# Altium schematic sheet MAP.SchDoc
size 231 x 317 mm
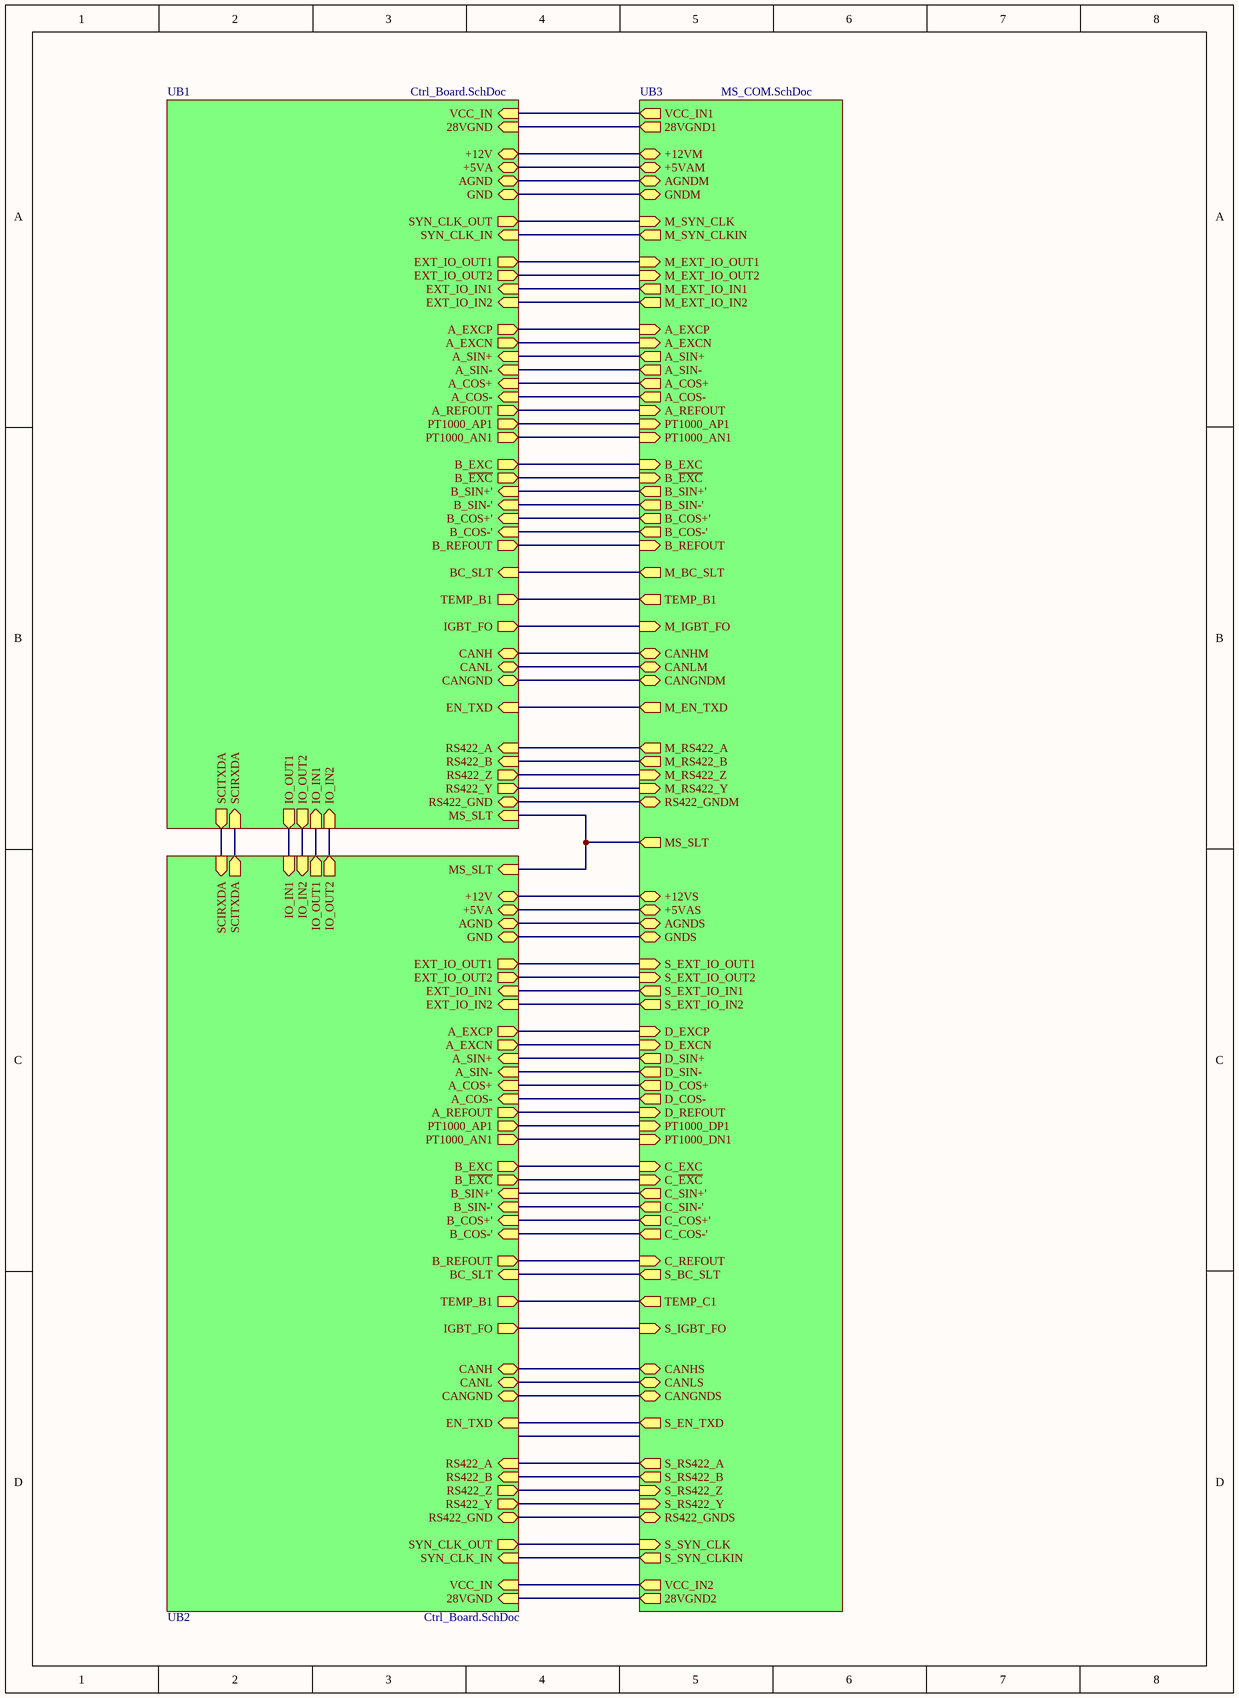
[diagram p0: MAP.SchDoc]

## Sub-sheets
UB1 = Ctrl_Board.SchDoc: IO_IN1 (in), IO_OUT1 (out), IO_OUT2 (out), IO_IN2 (in), IGBT_FO (out), EN_TXD (in), BC_SLT (in), B_EXC (out), B_SIN+' (in), B_~{EXC} (out), B_SIN-' (in), B_COS+' (in), B_COS-' (in), B_REFOUT (out), TEMP_B1 (out), RS422_A (in), RS422_B (in), RS422_Z (out), RS422_Y (out), CANL (bidir), CANH (bidir), SCIRXDA (in), SCITXDA (out), EXT_IO_OUT1 (out), EXT_IO_OUT2 (out), EXT_IO_IN1 (in), EXT_IO_IN2 (in), MS_SLT (in), CANGND (bidir), RS422_GND (bidir), +5VA (bidir), AGND (bidir), GND (bidir), +12V (bidir), SYN_CLK_IN (in), SYN_CLK_OUT (out), A_EXCP (out), A_SIN+ (in), A_EXCN (out), A_SIN- (in), A_COS+ (in), A_COS- (in), A_REFOUT (out), PT1000_AP1 (out), PT1000_AN1 (out), VCC_IN (in), 28VGND (in)
UB2 = Ctrl_Board.SchDoc: IO_IN1 (in), IO_OUT1 (out), IO_OUT2 (out), IO_IN2 (in), IGBT_FO (out), EN_TXD (in), BC_SLT (in), B_EXC (out), B_SIN+' (in), B_~{EXC} (out), B_SIN-' (in), B_COS+' (in), B_COS-' (in), B_REFOUT (out), TEMP_B1 (out), RS422_A (in), RS422_B (in), RS422_Z (out), RS422_Y (out), CANL (bidir), CANH (bidir), SCIRXDA (in), SCITXDA (out), EXT_IO_OUT1 (out), EXT_IO_OUT2 (out), EXT_IO_IN1 (in), EXT_IO_IN2 (in), MS_SLT (in), CANGND (bidir), RS422_GND (bidir), +5VA (bidir), AGND (bidir), GND (bidir), +12V (bidir), SYN_CLK_IN (in), SYN_CLK_OUT (out), A_EXCP (out), A_SIN+ (in), A_EXCN (out), A_SIN- (in), A_COS+ (in), A_COS- (in), A_REFOUT (out), PT1000_AP1 (out), PT1000_AN1 (out), VCC_IN (in), 28VGND (in)
UB3 = MS_COM.SchDoc: B_EXC (in), B_~{EXC} (in), B_SIN+' (out), B_SIN-' (out), B_COS+' (out), B_COS-' (out), B_REFOUT (in), TEMP_B1 (out), M_BC_SLT (out), M_IGBT_FO (in), M_EN_TXD (out), S_IGBT_FO (in), S_EN_TXD (out), S_BC_SLT (out), C_EXC (in), C_~{EXC} (in), C_SIN+' (out), C_SIN-' (out), C_COS+' (out), C_COS-' (out), C_REFOUT (in), TEMP_C1 (out), CANLS (bidir), CANHS (bidir), CANLM (bidir), CANHM (bidir), S_RS422_A (out), S_RS422_B (out), S_RS422_Z (in), S_RS422_Y (in), M_RS422_A (out), M_RS422_B (out), M_RS422_Z (in), M_RS422_Y (in), S_EXT_IO_OUT1 (in), S_EXT_IO_OUT2 (in), S_EXT_IO_IN1 (out), S_EXT_IO_IN2 (out), M_EXT_IO_OUT1 (in), M_EXT_IO_OUT2 (in), M_EXT_IO_IN1 (out), M_EXT_IO_IN2 (out), MS_SLT (out), CANGNDM (bidir), CANGNDS (bidir), RS422_GNDS (bidir), RS422_GNDM (bidir), +5VAM (bidir), AGNDM (bidir), GNDM (bidir), +12VM (bidir), +5VAS (bidir), AGNDS (bidir), GNDS (bidir), +12VS (bidir), M_SYN_CLK (in), M_SYN_CLKIN (out), S_SYN_CLK (in), S_SYN_CLKIN (out), A_EXCP (in), A_SIN+ (out), A_EXCN (in), A_SIN- (out), A_COS+ (out), A_COS- (out), A_REFOUT (in), PT1000_AP1 (in), PT1000_AN1 (in), D_EXCP (in), D_SIN+ (out), D_EXCN (in), D_SIN- (out), D_COS+ (out), D_COS- (out), D_REFOUT (in), PT1000_DP1 (in), PT1000_DN1 (in), VCC_IN1 (out), 28VGND1 (out), VCC_IN2 (out), 28VGND2 (out)

## Nets
(unnamed): sheet UB1/IO_IN1, sheet UB2/IO_OUT1
(unnamed): sheet UB1/IO_OUT1, sheet UB2/IO_IN1
(unnamed): sheet UB1/IO_OUT2, sheet UB2/IO_IN2
(unnamed): sheet UB1/IO_IN2, sheet UB2/IO_OUT2
(unnamed): sheet UB1/IGBT_FO, sheet UB3/M_IGBT_FO
(unnamed): sheet UB1/EN_TXD, sheet UB3/M_EN_TXD
(unnamed): sheet UB1/BC_SLT, sheet UB3/M_BC_SLT
(unnamed): sheet UB1/B_EXC, sheet UB3/B_EXC
(unnamed): sheet UB1/B_SIN+', sheet UB3/B_SIN+'
(unnamed): sheet UB1/B_~{EXC}, sheet UB3/B_~{EXC}
(unnamed): sheet UB1/B_SIN-', sheet UB3/B_SIN-'
(unnamed): sheet UB1/B_COS+', sheet UB3/B_COS+'
(unnamed): sheet UB1/B_COS-', sheet UB3/B_COS-'
(unnamed): sheet UB1/B_REFOUT, sheet UB3/B_REFOUT
(unnamed): sheet UB1/TEMP_B1, sheet UB3/TEMP_B1
(unnamed): sheet UB1/RS422_A, sheet UB3/M_RS422_A
(unnamed): sheet UB1/RS422_B, sheet UB3/M_RS422_B
(unnamed): sheet UB1/RS422_Z, sheet UB3/M_RS422_Z
(unnamed): sheet UB1/RS422_Y, sheet UB3/M_RS422_Y
(unnamed): sheet UB1/CANL, sheet UB3/CANLM
(unnamed): sheet UB1/CANH, sheet UB3/CANHM
(unnamed): sheet UB1/SCIRXDA, sheet UB2/SCITXDA
(unnamed): sheet UB1/SCITXDA, sheet UB2/SCIRXDA
(unnamed): sheet UB1/EXT_IO_OUT1, sheet UB3/M_EXT_IO_OUT1
(unnamed): sheet UB1/EXT_IO_OUT2, sheet UB3/M_EXT_IO_OUT2
(unnamed): sheet UB1/EXT_IO_IN1, sheet UB3/M_EXT_IO_IN1
(unnamed): sheet UB1/EXT_IO_IN2, sheet UB3/M_EXT_IO_IN2
(unnamed): sheet UB1/MS_SLT, sheet UB3/MS_SLT, sheet UB2/MS_SLT
(unnamed): sheet UB1/CANGND, sheet UB3/CANGNDM
(unnamed): sheet UB1/RS422_GND, sheet UB3/RS422_GNDM
(unnamed): sheet UB1/+5VA, sheet UB3/+5VAM
(unnamed): sheet UB1/AGND, sheet UB3/AGNDM
(unnamed): sheet UB1/GND, sheet UB3/GNDM
(unnamed): sheet UB1/+12V, sheet UB3/+12VM
(unnamed): sheet UB1/SYN_CLK_IN, sheet UB3/M_SYN_CLKIN
(unnamed): sheet UB1/SYN_CLK_OUT, sheet UB3/M_SYN_CLK
(unnamed): sheet UB1/A_EXCP, sheet UB3/A_EXCP
(unnamed): sheet UB1/A_SIN+, sheet UB3/A_SIN+
(unnamed): sheet UB1/A_EXCN, sheet UB3/A_EXCN
(unnamed): sheet UB1/A_SIN-, sheet UB3/A_SIN-
(unnamed): sheet UB1/A_COS+, sheet UB3/A_COS+
(unnamed): sheet UB1/A_COS-, sheet UB3/A_COS-
(unnamed): sheet UB1/A_REFOUT, sheet UB3/A_REFOUT
(unnamed): sheet UB1/PT1000_AP1, sheet UB3/PT1000_AP1
(unnamed): sheet UB1/PT1000_AN1, sheet UB3/PT1000_AN1
(unnamed): sheet UB1/VCC_IN, sheet UB3/VCC_IN1
(unnamed): sheet UB1/28VGND, sheet UB3/28VGND1
(unnamed): sheet UB3/S_IGBT_FO, sheet UB2/IGBT_FO
(unnamed): sheet UB3/S_EN_TXD, sheet UB2/EN_TXD
(unnamed): sheet UB3/S_BC_SLT, sheet UB2/BC_SLT
(unnamed): sheet UB3/C_EXC, sheet UB2/B_EXC
(unnamed): sheet UB3/C_~{EXC}, sheet UB2/B_~{EXC}
(unnamed): sheet UB3/C_SIN+', sheet UB2/B_SIN+'
(unnamed): sheet UB3/C_SIN-', sheet UB2/B_SIN-'
(unnamed): sheet UB3/C_COS+', sheet UB2/B_COS+'
(unnamed): sheet UB3/C_COS-', sheet UB2/B_COS-'
(unnamed): sheet UB3/C_REFOUT, sheet UB2/B_REFOUT
(unnamed): sheet UB3/TEMP_C1, sheet UB2/TEMP_B1
(unnamed): sheet UB3/CANLS, sheet UB2/CANL
(unnamed): sheet UB3/CANHS, sheet UB2/CANH
(unnamed): sheet UB3/S_RS422_A, sheet UB2/RS422_A
(unnamed): sheet UB3/S_RS422_B, sheet UB2/RS422_B
(unnamed): sheet UB3/S_RS422_Z, sheet UB2/RS422_Z
(unnamed): sheet UB3/S_RS422_Y, sheet UB2/RS422_Y
(unnamed): sheet UB3/S_EXT_IO_OUT1, sheet UB2/EXT_IO_OUT1
(unnamed): sheet UB3/S_EXT_IO_OUT2, sheet UB2/EXT_IO_OUT2
(unnamed): sheet UB3/S_EXT_IO_IN1, sheet UB2/EXT_IO_IN1
(unnamed): sheet UB3/S_EXT_IO_IN2, sheet UB2/EXT_IO_IN2
(unnamed): sheet UB3/CANGNDS, sheet UB2/CANGND
(unnamed): sheet UB3/RS422_GNDS, sheet UB2/RS422_GND
(unnamed): sheet UB3/+5VAS, sheet UB2/+5VA
(unnamed): sheet UB3/AGNDS, sheet UB2/AGND
(unnamed): sheet UB3/GNDS, sheet UB2/GND
(unnamed): sheet UB3/+12VS, sheet UB2/+12V
(unnamed): sheet UB3/S_SYN_CLK, sheet UB2/SYN_CLK_OUT
(unnamed): sheet UB3/S_SYN_CLKIN, sheet UB2/SYN_CLK_IN
(unnamed): sheet UB3/D_EXCP, sheet UB2/A_EXCP
(unnamed): sheet UB3/D_SIN+, sheet UB2/A_SIN+
(unnamed): sheet UB3/D_EXCN, sheet UB2/A_EXCN
(unnamed): sheet UB3/D_SIN-, sheet UB2/A_SIN-
(unnamed): sheet UB3/D_COS+, sheet UB2/A_COS+
(unnamed): sheet UB3/D_COS-, sheet UB2/A_COS-
(unnamed): sheet UB3/D_REFOUT, sheet UB2/A_REFOUT
(unnamed): sheet UB3/PT1000_DP1, sheet UB2/PT1000_AP1
(unnamed): sheet UB3/PT1000_DN1, sheet UB2/PT1000_AN1
(unnamed): sheet UB3/VCC_IN2, sheet UB2/VCC_IN
(unnamed): sheet UB3/28VGND2, sheet UB2/28VGND